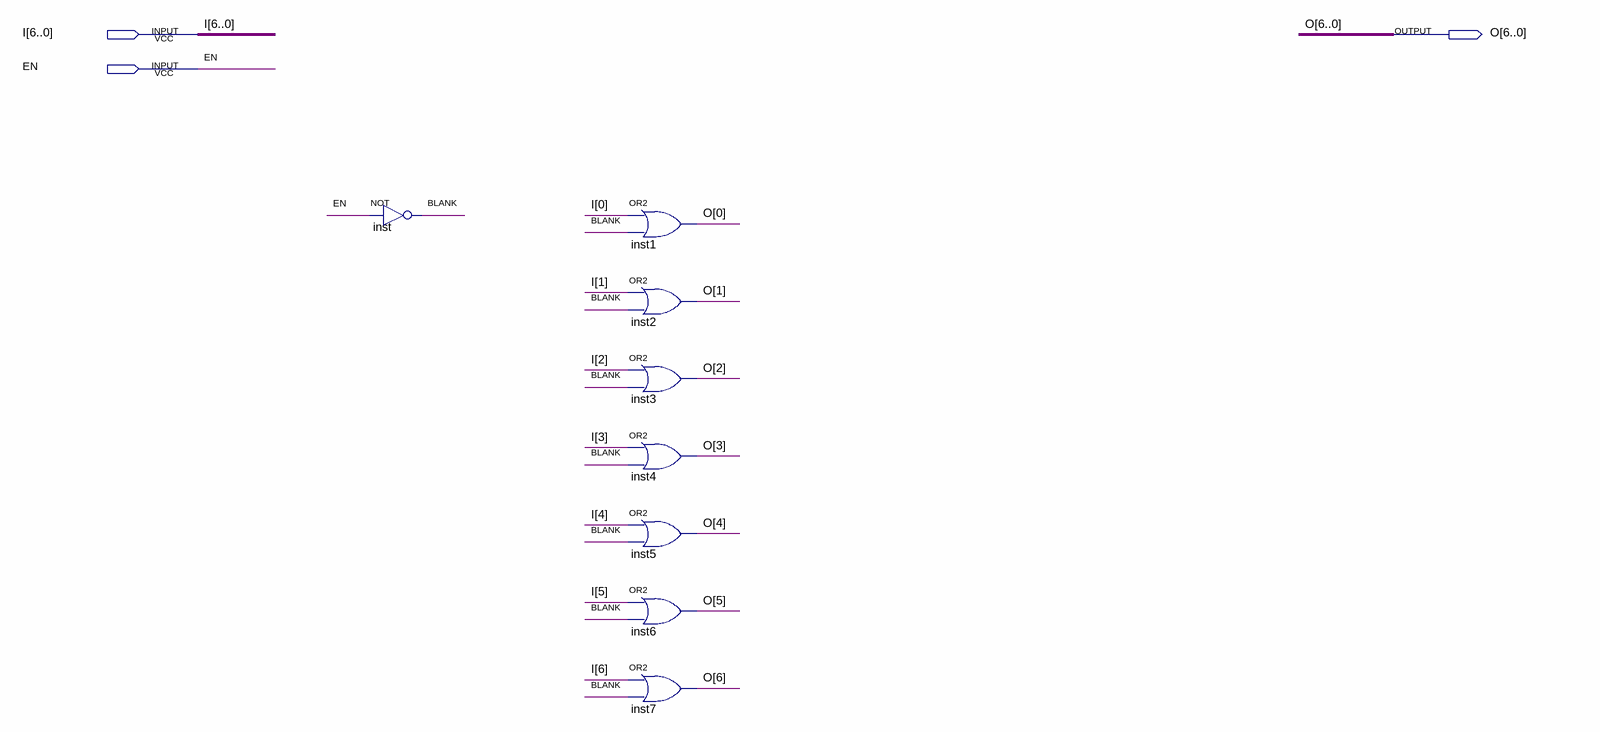
[diagram p0: schematic sheet]
// Quartus schematic apaga_display.bdf as structural Verilog: 8 symbols, 3 pins
module apaga_display (
  input  [6:0] I,
  input  EN,
  output [6:0] O
);

  wire BLANK;

  not inst (BLANK, EN);
  or inst1 (O[0], I[0], BLANK);
  or inst2 (O[1], I[1], BLANK);
  or inst3 (O[2], I[2], BLANK);
  or inst4 (O[3], I[3], BLANK);
  or inst5 (O[4], I[4], BLANK);
  or inst6 (O[5], I[5], BLANK);
  or inst7 (O[6], I[6], BLANK);
endmodule
